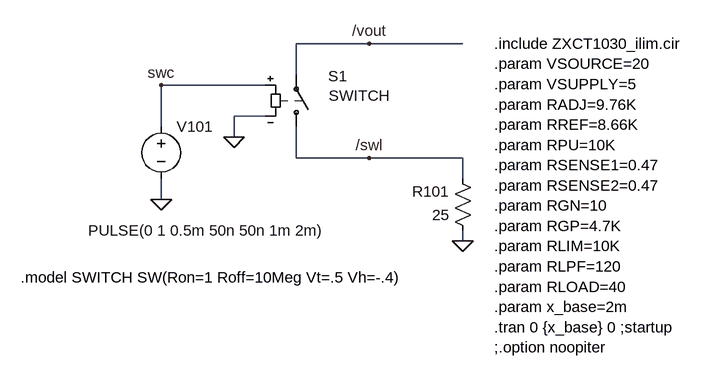
[diagram p0: schematic ZXCT1030_ilim.asc]
ZXCT1030_ilim.asc, the LTspice schematic file:
Version 4
SHEET 1 1276 680
WIRE 304 80 192 80
WIRE 448 80 304 80
WIRE 192 128 192 80
WIRE 144 144 -16 144
WIRE 144 192 96 192
WIRE -16 208 -16 144
WIRE 96 224 96 192
WIRE 192 256 192 208
WIRE 304 256 192 256
WIRE 448 256 304 256
WIRE 448 288 448 256
WIRE -16 320 -16 288
WIRE 448 384 448 368
FLAG 96 224 0
FLAG -16 320 0
FLAG -16 144 swc
FLAG 448 384 0
FLAG 304 80 /vout
FLAG 304 256 /swl
SYMBOL sw 192 224 M180
WINDOW 0 49 94 Left 2
WINDOW 3 50 64 Left 2
SYMATTR InstName S1
SYMATTR Value SWITCH
SYMBOL voltage -16 192 R0
WINDOW 3 -112 176 Left 2
WINDOW 123 0 0 Left 2
WINDOW 39 0 0 Left 2
SYMATTR Value PULSE(0 1 0.5m 50n 50n 1m 2m)
SYMATTR InstName V101
SYMBOL res 464 384 R180
WINDOW 0 36 76 Left 2
WINDOW 3 36 40 Left 2
SYMATTR InstName R101
SYMATTR Value 25
TEXT -232 440 Left 2 !.model SWITCH SW(Ron=1 Roff=10Meg Vt=.5 Vh=-.4)
TEXT 496 80 Left 2 !.include ZXCT1030_ilim.cir\n.param VSOURCE=20\n.param VSUPPLY=5\n.param RADJ=9.76K\n.param RREF=8.66K\n.param RPU=10K\n.param RSENSE1=0.47\n.param RSENSE2=0.47\n.param RGN=10\n.param RGP=4.7K\n.param RLIM=10K\n.param RLPF=120\n.param RLOAD=40\n.param x_base=2m\n.tran 0 {x_base} 0 ;startup\n;.option noopiter

The netlist it stands for:
* ZXCT1030_ilim.asc
S1 /swl /vout swc 0 SWITCH
V101 swc 0 PULSE(0 1 0.5m 50n 50n 1m 2m)
R101 0 /swl 25
.model SWITCH SW(Ron=1 Roff=10Meg Vt=.5 Vh=-.4)
.include ZXCT1030_ilim.cir
.param VSOURCE=20
.param VSUPPLY=5
.param RADJ=9.76K
.param RREF=8.66K
.param RPU=10K
.param RSENSE1=0.47
.param RSENSE2=0.47
.param RGN=10
.param RGP=4.7K
.param RLIM=10K
.param RLPF=120
.param RLOAD=40
.param x_base=2m
.tran 0 {x_base} 0 ;startup
;.option noopiter
.backanno
.end